# Altium schematic sheet Sheet_1_2021-12-20.schdoc
size 59 x 42 mm
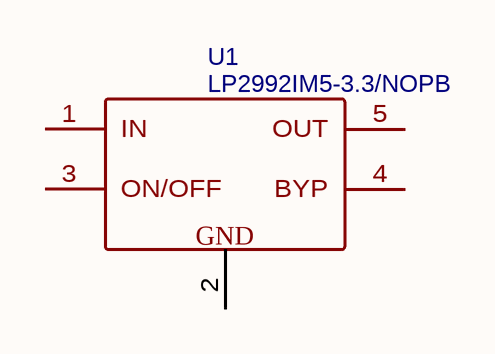
[diagram p0: Sheet_1_2021-12-20.schdoc]

## Parts
U1  LP2992IM5-3.3/NOPB  [SOT-23-5_L3.0-W1.7-P0.95-LS2.8-BR]

## Nets

Not connected (* = marked no-connect by the designer): U1 1(IN) 2(GND) 3(ON/OFF) 4(BYP) 5(OUT)

## Library data of the parts
U1 = LP2992IM5-3.3/NOPB: BOM_Manufacturer: TI; Contributor: LCSC; BOM_Supplier: LCSC; BOM_Manufacturer Part: LP2992IM5-3.3/NOPB; BOM_Supplier Part: C129353; BOM_JLCPCB Part Class: Extended Part; spicePre: U; spiceSymbolName: LP2992IM5-3.3/NOPB